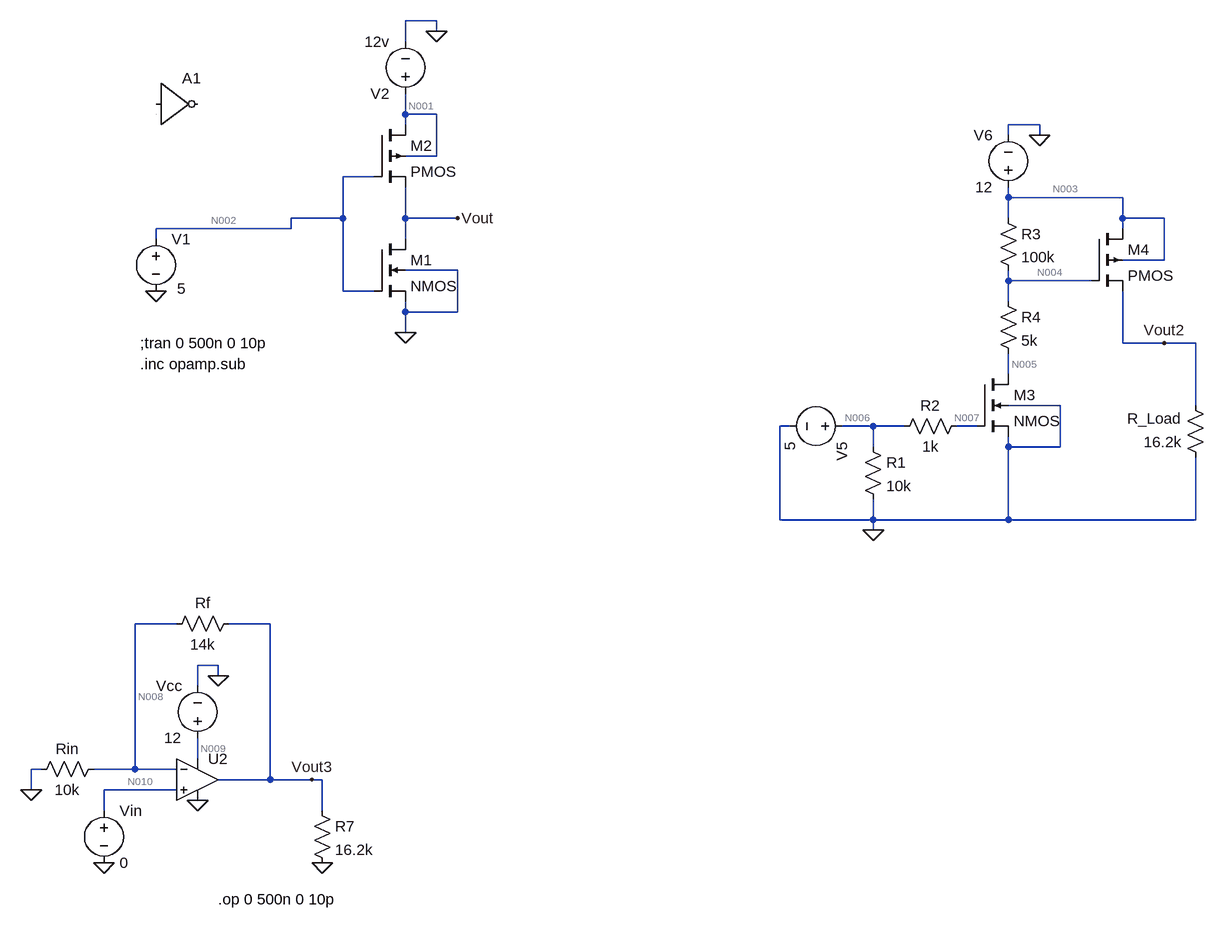
[diagram p0: schematic MOS_driver.asc]
MOS_driver.asc, the LTspice schematic file:
Version 4
SHEET 1 1828 1316
WIRE 560 -96 512 -96
WIRE 560 -80 560 -96
WIRE 512 -64 512 -96
WIRE 512 48 512 16
WIRE 560 48 512 48
WIRE 512 64 512 48
WIRE 1488 64 1440 64
WIRE 1440 80 1440 64
WIRE 1488 80 1488 64
WIRE 560 112 560 48
WIRE 560 112 512 112
WIRE 464 144 416 144
WIRE 1440 176 1440 160
WIRE 1616 176 1440 176
WIRE 416 208 416 144
WIRE 416 208 336 208
WIRE 512 208 512 160
WIRE 592 208 512 208
WIRE 1440 208 1440 176
WIRE 1616 208 1616 176
WIRE 1680 208 1616 208
WIRE 336 224 336 208
WIRE 336 224 128 224
WIRE 1616 224 1616 208
WIRE 128 240 128 224
WIRE 512 240 512 208
WIRE 1680 272 1680 208
WIRE 1680 272 1616 272
WIRE 592 288 512 288
WIRE 1440 304 1440 288
WIRE 1568 304 1440 304
WIRE 416 320 416 208
WIRE 464 320 416 320
WIRE 1440 336 1440 304
WIRE 512 352 512 336
WIRE 592 352 592 288
WIRE 592 352 512 352
WIRE 512 384 512 352
WIRE 1616 400 1616 320
WIRE 1680 400 1616 400
WIRE 1728 400 1680 400
WIRE 1440 448 1440 416
WIRE 1520 496 1440 496
WIRE 1728 496 1728 400
WIRE 1104 528 1088 528
WIRE 1232 528 1184 528
WIRE 1280 528 1232 528
WIRE 1392 528 1360 528
WIRE 1232 560 1232 528
WIRE 1440 560 1440 544
WIRE 1520 560 1520 496
WIRE 1520 560 1440 560
WIRE 1088 672 1088 528
WIRE 1232 672 1232 640
WIRE 1232 672 1088 672
WIRE 1440 672 1440 560
WIRE 1440 672 1232 672
WIRE 1728 672 1728 576
WIRE 1728 672 1440 672
WIRE 1232 688 1232 672
WIRE 160 832 96 832
WIRE 304 832 240 832
WIRE 224 896 192 896
WIRE 224 912 224 896
WIRE 192 928 192 896
WIRE 192 1040 192 1008
WIRE -48 1056 -64 1056
WIRE 96 1056 96 832
WIRE 96 1056 32 1056
WIRE 160 1056 96 1056
WIRE 304 1072 304 832
WIRE 304 1072 224 1072
WIRE 368 1072 304 1072
WIRE 384 1072 368 1072
WIRE -64 1088 -64 1056
WIRE 160 1088 48 1088
WIRE 48 1120 48 1088
WIRE 384 1120 384 1072
FLAG 560 -80 0
FLAG 512 384 0
FLAG 128 320 0
FLAG 592 208 Vout
FLAG 1680 400 Vout2
FLAG 1232 688 0
FLAG 1488 80 0
FLAG 384 1200 0
FLAG 224 912 0
FLAG 192 1104 0
FLAG 48 1200 0
FLAG -64 1088 0
FLAG 368 1072 Vout3
SYMBOL Digital\\inv 128 -32 R0
SYMATTR InstName A1
SYMBOL voltage 128 224 R0
WINDOW 3 33 92 Left 2
WINDOW 123 0 0 Left 0
WINDOW 39 0 0 Left 0
SYMATTR Value 5
SYMATTR InstName V1
SYMBOL voltage 512 32 R180
WINDOW 123 0 0 Left 0
WINDOW 39 0 0 Left 0
SYMATTR InstName V2
SYMATTR Value 12v
SYMBOL pmos4 464 64 R0
SYMATTR InstName M2
SYMBOL nmos4 464 240 R0
SYMATTR InstName M1
SYMBOL voltage 1200 528 R90
WINDOW 123 0 0 Left 0
WINDOW 39 0 0 Left 0
SYMATTR InstName V5
SYMATTR Value 5
SYMBOL voltage 1440 176 R180
WINDOW 0 24 96 Left 2
WINDOW 3 24 16 Left 2
WINDOW 123 0 0 Left 0
WINDOW 39 0 0 Left 0
SYMATTR InstName V6
SYMATTR Value 12
SYMBOL res 1376 512 R90
WINDOW 0 0 56 VBottom 2
WINDOW 3 32 56 VTop 2
SYMATTR InstName R2
SYMATTR Value 1k
SYMBOL res 1744 592 R180
WINDOW 0 36 76 Left 2
WINDOW 3 36 40 Left 2
SYMATTR InstName R_Load
SYMATTR Value 16.2k
SYMBOL nmos4 1392 448 R0
SYMATTR InstName M3
SYMBOL pmos4 1568 224 R0
SYMATTR InstName M4
SYMBOL res 1216 544 R0
SYMATTR InstName R1
SYMATTR Value 10k
SYMBOL res 1424 192 R0
SYMATTR InstName R3
SYMATTR Value 100k
SYMBOL res 1424 320 R0
SYMATTR InstName R4
SYMATTR Value 5k
SYMBOL res 48 1040 R90
WINDOW 0 0 56 VBottom 2
WINDOW 3 32 56 VTop 2
SYMATTR InstName Rin
SYMATTR Value 10k
SYMBOL res 368 1104 R0
SYMATTR InstName R7
SYMATTR Value 16.2k
SYMBOL voltage 48 1104 R0
WINDOW 123 0 0 Left 0
WINDOW 39 0 0 Left 0
SYMATTR InstName Vin
SYMATTR Value 0
SYMBOL voltage 192 1024 R180
WINDOW 0 24 96 Left 2
WINDOW 3 24 16 Left 2
WINDOW 123 0 0 Left 0
WINDOW 39 0 0 Left 0
SYMATTR InstName Vcc
SYMATTR Value 12
SYMBOL res 256 816 R90
WINDOW 0 0 56 VBottom 2
WINDOW 3 32 56 VTop 2
SYMATTR InstName Rf
SYMATTR Value 14k
SYMBOL OpAmps\\UniversalOpamp2 192 1072 R0
SYMATTR InstName U2
TEXT 104 400 Left 2 !;tran 0 500n 0 10p
TEXT 104 432 Left 2 !.inc opamp.sub
TEXT 224 1256 Left 2 !.op 0 500n 0 10p

The netlist it stands for:
* MOS_driver.asc
A1 0 0 0 0 0 0 0 0 BUF
V1 N002 0 5
V2 N001 0 12v
M2 N001 N002 Vout N001 PMOS
M1 Vout N002 0 0 NMOS
V5 N006 0 5
V6 N003 0 12
R2 N007 N006 1k
R_Load 0 Vout2 16.2k
M3 N005 N007 0 0 NMOS
M4 N003 N004 Vout2 N003 PMOS
R1 N006 0 10k
R3 N003 N004 100k
R4 N004 N005 5k
Rin N008 0 10k
R7 Vout3 0 16.2k
Vin N010 0 0
Vcc N009 0 12
Rf Vout3 N008 14k
XU2 N010 N008 N009 0 Vout3 level.2 Avol=1Meg GBW=10Meg Slew=10Meg ilimit=25m rail=0 Vos=0 phimargin=45 en=0 enk=0 in=0 ink=0 Rin=500Meg  ; pins IN+ IN- V+ V- OUT
.model NMOS NMOS
.model PMOS PMOS
.lib standard.mos
;tran 0 500n 0 10p
.inc opamp.sub
.op 0 500n 0 10p
.lib UniversalOpamps2.sub
.backanno
.end

* Results of the author's LTspice run, read from the files saved beside the schematic
* Operating Point:
*   V(n002) = 5 V
*   V(n001) = 12 V
*   V(vout) = 9.899 V
*   V(n006) = 5 V
*   V(n003) = 12 V
*   V(n007) = 5 V
*   V(vout2) = 8.871 V
*   V(n005) = 1.168 V
*   V(n004) = 1.684 V
*   V(n008) = 3.266 mV
*   V(vout3) = 7.67 mV
*   V(n010) = 0 V
*   V(n009) = 12 V
*   Id(M3) = 103.2 µA
*   Ig(M3) = 0 A
*   Ib(M3) = -1.178 pA
*   Is(M3) = -103.2 µA
*   Id(M1) = 250 µA
*   Ig(M1) = 0 A
*   Ib(M1) = -9.909 pA
*   Is(M1) = -250 µA
*   Id(M4) = 547.6 µA
*   Ig(M4) = 0 A
*   Ib(M4) = 3.139 pA
*   Is(M4) = -547.6 µA
*   Id(M2) = 250 µA
*   Ig(M2) = 0 A
*   Ib(M2) = 2.111 pA
*   Is(M2) = -250 µA
*   I(Rf) = 314.6 nA
*   I(R7) = 473.5 nA
*   I(Rin) = 326.6 nA
*   I(R4) = 103.2 µA
*   I(R3) = 103.2 µA
*   I(R1) = 500 µA
*   I(R_load) = -547.6 µA
*   I(R2) = 0 A
*   I(Vcc) = -30.81 µA
*   I(Vin) = 12 nA
*   I(V6) = -650.8 µA
*   I(V5) = -500 µA
*   I(V2) = -250 µA
*   I(V1) = 0 A
*   Ix(u2:1) = -12 nA
*   Ix(u2:2) = -11.99 nA
*   Ix(u2:3) = 30.81 µA
*   Ix(u2:4) = -29.94 µA
*   Ix(u2:5) = -788 nA
* From the log:
*   Semiconductor Device Operating Points:
*                           --- MOSFET Transistors ---
*   Name:          m3          m1          m4          m2
*   Model:        nmos        nmos        pmos        pmos
*   Id:          1.03e-04    2.50e-04    5.48e-04    2.50e-04
*   Vgs:         5.00e+00    5.00e+00   -7.19e+00   -4.90e+00
*   Vds:         1.17e+00    9.90e+00    3.13e+00    2.10e+00
*   Vbs:         0.00e+00    0.00e+00    3.13e+00    2.10e+00
*   Vth:         0.00e+00    0.00e+00   -0.00e+00   -0.00e+00
*   Vdsat:       5.00e+00    5.00e+00   -1.03e+01   -7.00e+00
*   Gm:          2.34e-05    1.00e-04    6.26e-05    4.20e-05
*   Gds:         7.66e-05    0.00e+00    1.44e-04    9.80e-05
*   Gmb:         0.00e+00    0.00e+00    0.00e+00    0.00e+00
*   Cbd:         0.00e+00    0.00e+00    0.00e+00    0.00e+00
*   Cbs:         0.00e+00    0.00e+00    0.00e+00    0.00e+00
*   Cgsov:       0.00e+00    0.00e+00    0.00e+00    0.00e+00
*   Cgdov:       0.00e+00    0.00e+00    0.00e+00    0.00e+00
*   Cgbov:       0.00e+00    0.00e+00    0.00e+00    0.00e+00
*   Cgs:         0.00e+00    0.00e+00    0.00e+00    0.00e+00
*   Cgd:         0.00e+00    0.00e+00    0.00e+00    0.00e+00
*   Cgb:         0.00e+00    0.00e+00    0.00e+00    0.00e+00